# Altium schematic sheet ADC_Connectors.SchDoc
size A; SheetNumber: 2; SheetTotal: 2
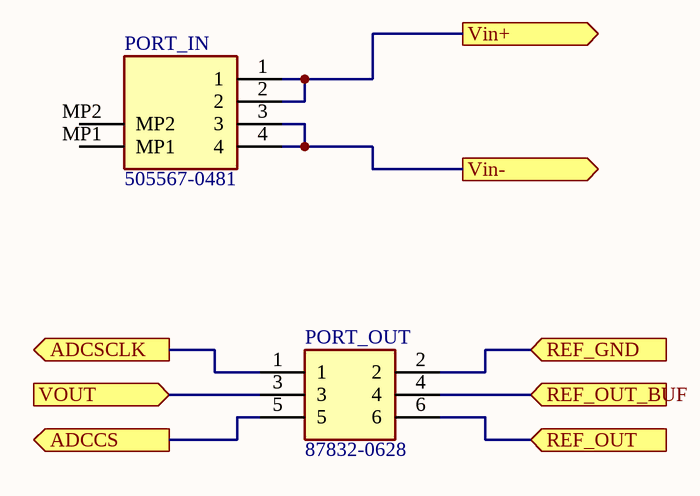
[diagram p0: ADC_Connectors.SchDoc]

## Parts
PORT_IN  505567-0481  [5055670481]
PORT_OUT  87832-0628  [878320628]

## Ports
ADCCS (out), ADCSCLK (out), REF_GND (in), REF_OUT (in), REF_OUT_BUF (in), Vin+ (out), Vin- (out), VOUT (in)

## Nets
ADCCS: PORT_OUT.5 ; port ADCCS
ADCSCLK: PORT_OUT.1 ; port ADCSCLK
REF_GND: PORT_OUT.2 ; port REF_GND
REF_OUT: PORT_OUT.6 ; port REF_OUT
REF_OUT_BUF: PORT_OUT.4 ; port REF_OUT_BUF
Vin+: PORT_IN.1 PORT_IN.2 ; port Vin+
Vin-: PORT_IN.3 PORT_IN.4 ; port Vin-
VOUT: PORT_OUT.3 ; port VOUT

Not connected (* = marked no-connect by the designer): PORT_IN MP1 MP2

## Library data of the parts
PORT_IN = 505567-0481: Connector; Manufacturer_Name: Molex; Datasheet Link: https://www.molex.com/pdm_docs/sd/5055670481_sd.pdf?webSyncID=090114e7-ea8e-9787-c070-e8582bec0296&sessionGUID=29b40bcb-654c-95cb-c1cd-5a8d15012bd5; Height: 4.2mm; Manufacturer_Part_Number: 505567-0481
PORT_OUT = 87832-0628: Connector; Manufacturer_Name: Molex; Datasheet Link: https://www.molex.com/pdm_docs/sd/878322020_sd.pdf; Height: 7.8mm; Manufacturer_Part_Number: 87832-0628